# EAGLE design ampi (EAGLE 9.6.2)
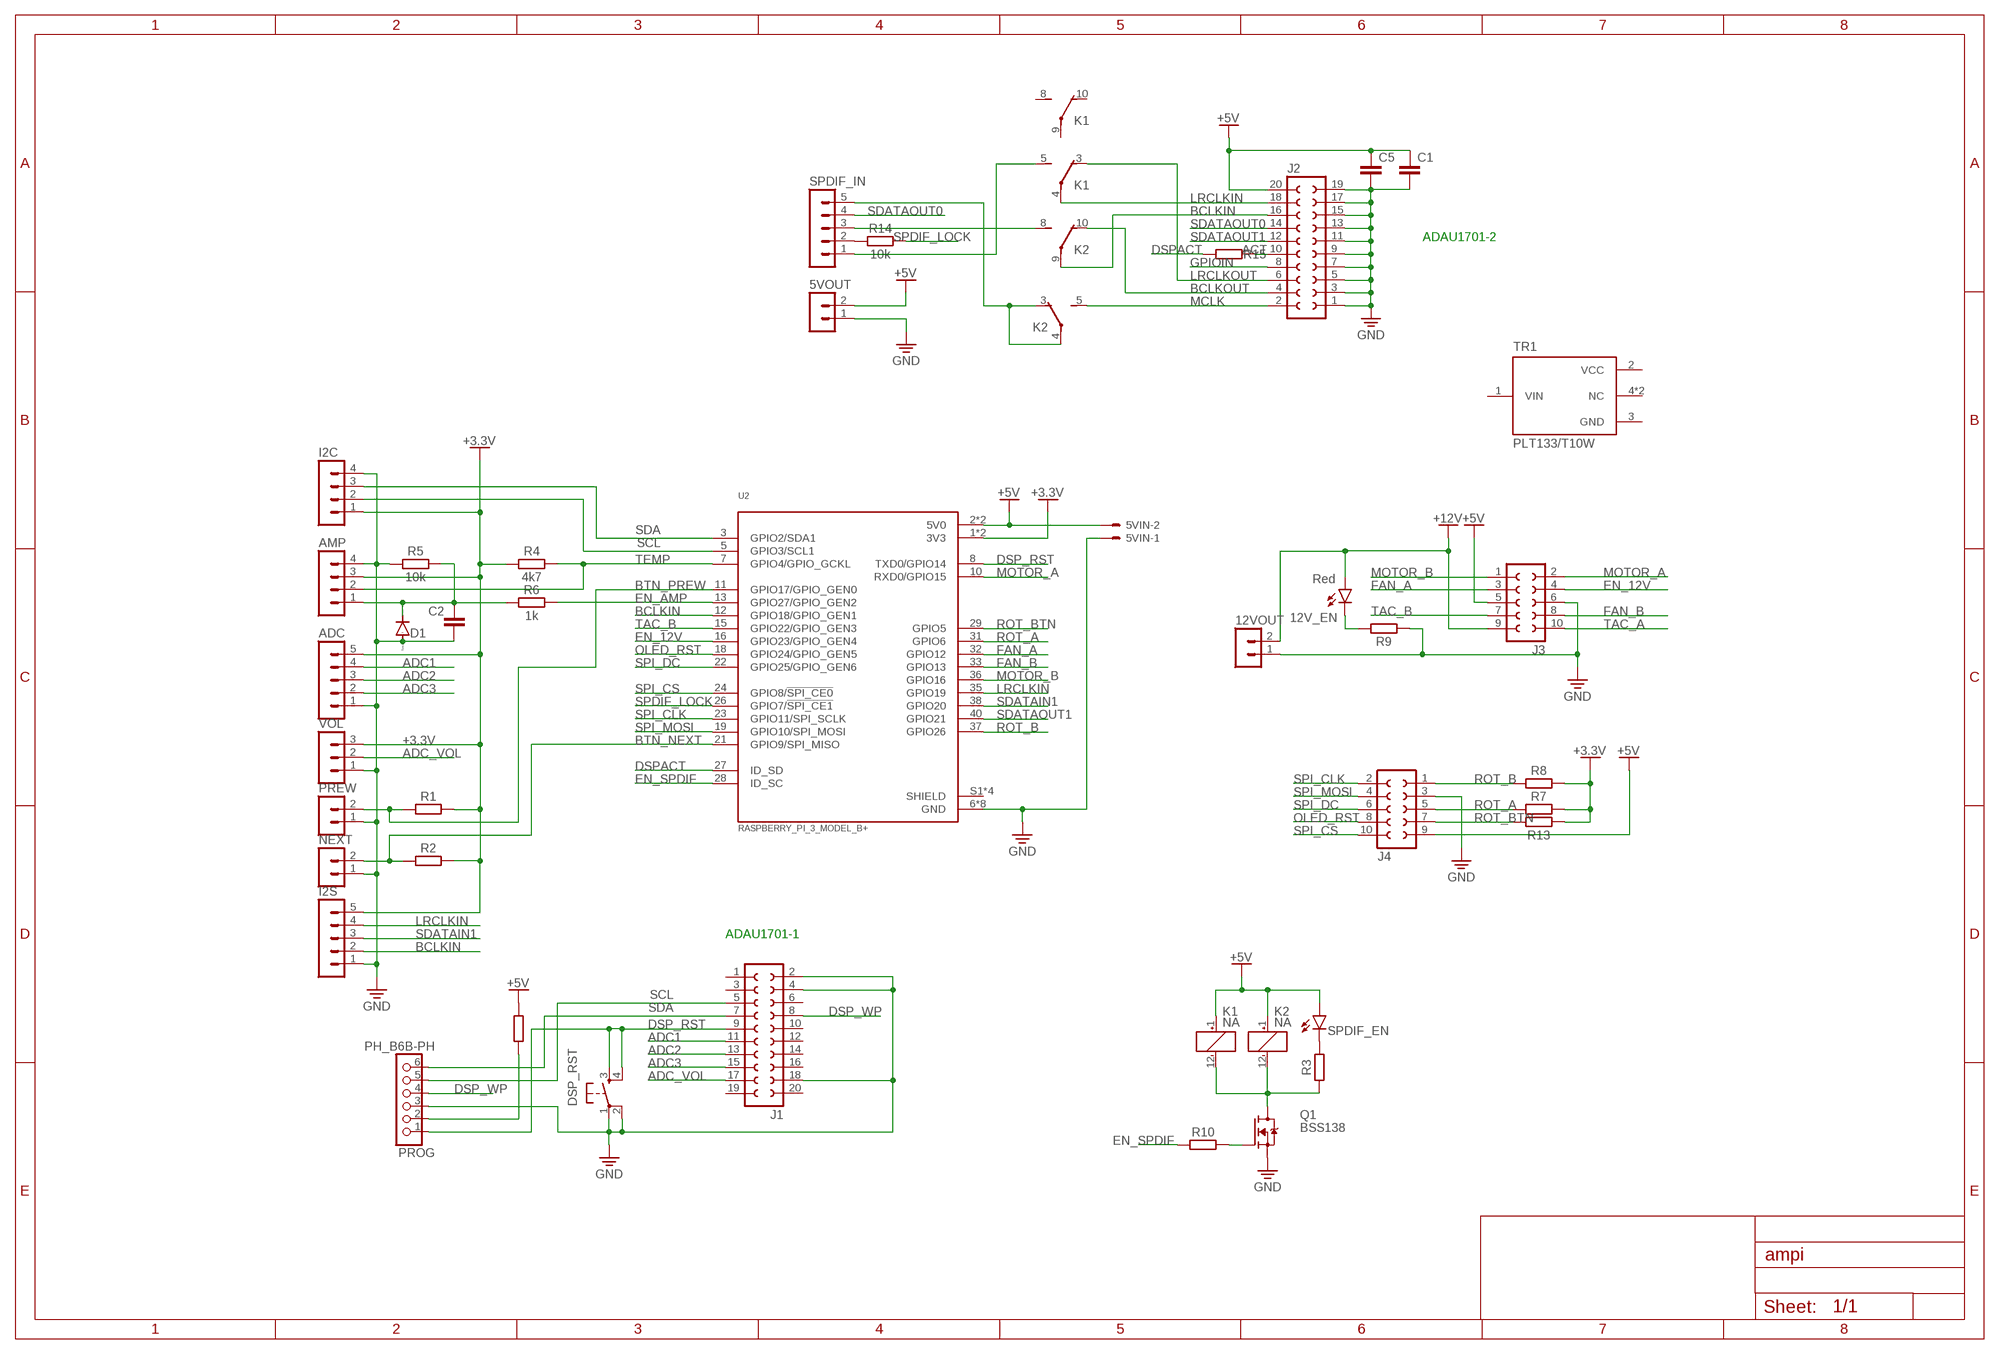
[diagram p0: schematic, sheet 1]

## Parts
5VIN  JST-XH-02-PIN-LONG-PAD  [JST-XH-02-PACKAGE-LONG-PAD]
5VOUT  S2B-EH  [S2B-EH]
12V_EN  Red  LEDCHIP-LED0805  [CHIP-LED0805]
12VOUT  S2B-EH  [S2B-EH]
ADC  S5B-EH  [S5B-EH]
AMP  S4B-EH  [S4B-EH]
C1  C7.5/4  [C7.5B4]
C2  C_CHIP-0603(1608-METRIC)  [CAPC1608X85]
C5  C-EUC0805K  [C0805K]
D1  CGRM4001-G  [SOD-123_MINI-SMA]
DSP_RST  DTS-6  [DTS-6]
I2C  S4B-EH  [S4B-EH]
I2S  S5B-EH  [S5B-EH]
J1  SOCKET-20V  [S20V]
J2  SOCKET-20V  [S20V]
J3  SOCKET-10V  [S10V]
J4  SOCKET-10V  [S10V]
K1  NA  [NA]
K2  NA  [NA]
NEXT  S2B-EH  [S2B-EH]
PREW  S2B-EH  [S2B-EH]
PROG  PH_B6B-PH  [B6B-PH]
Q1  BSS138  [SOT23]
R1  R_CHIP-0603(1608-METRIC)  [RESC1608X60]
R2  R_CHIP-0603(1608-METRIC)  [RESC1608X60]
R3  R_CHIP-0603(1608-METRIC)  [RESC1608X60]
R4  4k7  R_CHIP-0603(1608-METRIC)  [RESC1608X60]
R5  10k  R_CHIP-0603(1608-METRIC)  [RESC1608X60]
R6  1k  R_CHIP-0603(1608-METRIC)  [RESC1608X60]
R7  R_CHIP-0603(1608-METRIC)  [RESC1608X60]
R8  R_CHIP-0603(1608-METRIC)  [RESC1608X60]
R9  R_CHIP-0603(1608-METRIC)  [RESC1608X60]
R10  R_CHIP-0603(1608-METRIC)  [RESC1608X60]
R12  R_CHIP-0402(1005-METRIC)  [RESC1005X40]
R13  R_CHIP-0603(1608-METRIC)  [RESC1608X60]
R14  10k  R_CHIP-0603(1608-METRIC)  [RESC1608X60]
R15  R_CHIP-0603(1608-METRIC)  [RESC1608X60]
SPDIF_EN  LEDCHIP-LED0805  [CHIP-LED0805]
SPDIF_IN  S5B-EH  [S5B-EH]
TR1  PLT133/T10W  [XDCR_PLT133/T10W]
U2  RASPBERRY_PI_3_MODEL_B+  [MODULE_RASPBERRY_PI_3_MODEL_B+]
VOL  S3B-EH  [S3B-EH]

## Nets
+3.3V: ADC.5 AMP.3 I2C.1 I2S.5 R1.2 R2.2 R4.1 R7.2 R8.2 R13.2 U2.1(3V3) U2.17(3V3) VOL.3
+5V: 5VIN.2 5VOUT.2 C1.1 C5.1 J2.20 J3.5 J4.9 K1.1(1:+) K2.1(1:+) R12.2 SPDIF_EN.A U2.2(5V0) U2.4(5V0)
+12V: 12V_EN.A 12VOUT.2 J3.9
ACT: J2.10 R15.2
ADC1: ADC.4 J1.11
ADC2: ADC.3 J1.13
ADC3: ADC.2 J1.15
ADC_VOL: J1.17 VOL.2
BCLKIN: I2S.2 J2.16 K2.9(3:P) U2.12(GPIO18/GPIO_GEN1)
BCLKOUT: J2.4 K2.10(3:O)
BTN_NEXT: NEXT.2 R2.1 U2.21(GPIO9/SPI_MISO)
BTN_PREW: PREW.2 R1.1 U2.11(GPIO17/GPIO_GEN0)
DSP_RST: DSP_RST.3 DSP_RST.4 J1.9 PROG.1 U2.8(TXD0/GPIO14)
DSP_WP: J1.8 PROG.4
DSPACT: R15.1 U2.27(ID_SD)
EN_12V: J3.4 U2.16(GPIO23/GPIO_GEN4)
EN_AMP: R6.2 U2.13(GPIO27/GPIO_GEN2)
EN_SPDIF: R10.1 U2.28(ID_SC)
FAN_A: J3.3 U2.32(GPIO12)
FAN_B: J3.8 U2.33(GPIO13)
GND: 5VIN.1 5VOUT.1 12VOUT.1 ADC.1 AMP.4 C1.2 C2.2 C5.2 D1.A DSP_RST.1 DSP_RST.2 I2C.4 I2S.1 J1.2 J1.4 J1.18 J2.1 J2.3 J2.5 J2.7 J2.9 J2.11 J2.13 J2.15 J2.17 J2.19 J3.6 J4.3 NEXT.1 PREW.1 PROG.3 Q1.2(S) R5.1 R9.2 U2.6(GND) U2.9(GND) U2.14(GND) U2.20(GND) U2.25(GND) U2.30(GND) U2.34(GND) U2.39(GND) VOL.1
GPIOIN: J2.8
LRCLKIN: I2S.4 J2.18 K1.4(2:P) U2.35(GPIO19)
LRCLKOUT: J2.6 K1.3(2:O)
MCLK: J2.2 K2.5(2:S)
MOTOR_A: J3.2 U2.10(RXD0/GPIO15)
MOTOR_B: J3.1 U2.36(GPIO16)
N$1: R3.2 SPDIF_EN.C
N$2: K1.12(1:-) K2.12(1:-) Q1.3(D) R3.1
N$3: R14.1 SPDIF_IN.2
N$6: 12V_EN.C R9.1
N$7: Q1.1(G) R10.2
N$8: K2.8(3:S) SPDIF_IN.3
N$9: K2.3(2:O) K2.4(2:P) SPDIF_IN.5
N$10: PROG.2 R12.1
N$11: K1.5(2:S) SPDIF_IN.1
N$12: AMP.1 C2.1 D1.C R5.2 R6.1
OLED_RST: J4.8 U2.18(GPIO24/GPIO_GEN5)
ROT_A: J4.5 R7.1 U2.31(GPIO6)
ROT_B: J4.1 R8.1 U2.37(GPIO26)
ROT_BTN: J4.7 R13.1 U2.29(GPIO5)
SCL: I2C.2 J1.5 PROG.5 U2.5(GPIO3/SCL1)
SDA: I2C.3 J1.7 PROG.6 U2.3(GPIO2/SDA1)
SDATAIN1: I2S.3 U2.38(GPIO20)
SDATAOUT0: J2.14 SPDIF_IN.4
SDATAOUT1: J2.12 U2.40(GPIO21)
SPDIF_LOCK: R14.2 U2.26(GPIO7/!SPI_CE1!)
SPI_CLK: J4.2 U2.23(GPIO11/SPI_SCLK)
SPI_CS: J4.10 U2.24(GPIO8/!SPI_CE0!)
SPI_DC: J4.6 U2.22(GPIO25/GPIO_GEN6)
SPI_MOSI: J4.4 U2.19(GPIO10/SPI_MOSI)
TAC_A: J3.10
TAC_B: J3.7 U2.15(GPIO22/GPIO_GEN3)
TEMP: AMP.2 R4.2 U2.7(GPIO4/GPIO_GCKL)
Unconnected: J1.1 J1.3 J1.6 J1.10 J1.12 J1.14 J1.16 J1.19 J1.20 K1.8(3:S) K1.9(3:P) K1.10(3:O) TR1.1(VIN) TR1.4(NC) TR1.5(NC)

## Notes on the sheet
- ADAU1701-2
- ADAU1701-1

## Power pins joined to a net without a drawn wire
GND: TR1.3(GND)
SHIELD: U2.S1(SHIELD) U2.S2(SHIELD) U2.S3(SHIELD) U2.S4(SHIELD)
VCC: TR1.2(VCC)

## Library data of the parts
5VIN = Rembrandt Electronics - JST XH Connectors v1-0 (1):JST-XH-02-PIN: JST XH Connector 2 Pin Wire to board connector. Pitch: 2,54 mm, (0.100") Number of pins: 2 Created by Rembrandt Electronics www.rembrandtelectronics.com
5VOUT 12VOUT NEXT PREW = con-JST EH:S2B-EH: JST EH series header 2.50mm pitch disconnectable crimp style connectors, horizontal (side entry type), 2 pins
12V_EN SPDIF_EN = led:LED: LED OSRAM: - CHIPLED LG R971, LG N971, LY N971, LG Q971, LY Q971, LO R971, LY R971 LH N974, LH R974 LS Q976, LO Q976, LY Q976 LO Q996 - Hyper CHIPLED LW Q18S LB Q993, LB Q99A, LB R99A - SideLED LS A670, LO A670, LY A670, LG A670, LP A670 LB A673, LV A673, LT A673, LW A673 LH A674 LY A675 LS A676, LA A676, LO A676, LY A676, LW A676 LS A679, LY A679, LG A679 - Hyper Micro SIDELED® LS Y876, LA Y876, LO Y876, LY Y876 LT Y87S - SmartLED LW L88C, LW L88S LB L89C, LB L89S, LG L890 LS L89K, LO L89K, LY L89K LS L896, LA L896, LO L896, LY L896 - TOPLED LS T670, LO T670, LY T670, LG T670, LP T670 LSG T670, LSP T670, LSY T670, LOP T670, LYG T670 LG T671, LOG T671, LSG T671 LB T673, LV T673, LT T673, LW T673 LH T674 LS T676, LA T676, LO T676, LY T676, LB T676, LH T676, LSB T676, LW T676 LB T67C, LV T67C, LT T67C, LS T67K, LO T67K, LY T67K, LW E67C LS E67B, LA E67B, LO E67B, LY E67B, LB E67C, LV E67C, LT E67C LW T67C LS T679, LY T679, LG T679 LS T770, LO T770, LY T770, LG T770, LP T770 LB T773, LV T773, LT T773, LW T773 LH T774 LS E675, LA E675, LY E675, LS T675 LS T776, LA T776, LO T776, LY T776, LB T776 LHGB T686 LT T68C, LB T68C - Hyper Mini TOPLED® LB M676 - Mini TOPLED Santana® LG M470 LS M47K, LO M47K, LY M47K Source: http://www.osram.convergy.de LUXEON: - LUMILED® LXK2-PW12-R00, LXK2-PW12-S00, LXK2-PW14-U00, LXK2-PW14-V00 LXK2-PM12-R00, LXK2-PM12-S00, LXK2-PM14-U00 LXK2-PE12-Q00, LXK2-PE12-R00, LXK2-PE12-S00, LXK2-PE14-T00, LXK2-PE14-U00 LXK2-PB12-K00, LXK2-PB12-L00, LXK2-PB12-M00, LXK2-PB14-N00, LXK2-PB14-P00, LXK2-PB14-Q00 LXK2-PR12-L00, LXK2-PR12-M00, LXK2-PR14-Q00, LXK2-PR14-R00 LXK2-PD12-Q00, LXK2-PD12-R00, LXK2-PD12-S00 LXK2-PH12-R00, LXK2-PH12-S00 LXK2-PL12-P00, LXK2-PL12-Q00, LXK2-PL12-R00 Source: www.luxeon.com KINGBRIGHT: KA-3528ASYC Source: www.kingbright.com
ADC I2S SPDIF_IN = con-JST EH:S5B-EH: JST EH series header 2.50mm pitch disconnectable crimp style connectors, horizontal (side entry type), 5 pins
AMP I2C = con-JST EH:S4B-EH: JST EH series header 2.50mm pitch disconnectable crimp style connectors, horizontal (side entry type), 4 pins
C1 = capacitor-wima:C: CAPACITOR naming: grid - package width
C2 = Capacitor:C: Capacitor - Generic; CATEGORY: Capacitor
C5 = resistor:C-EU: CAPACITOR, European symbol
D1 = diode:CGRM400*-G: Molded plasitc,JEDEC SOD-123/Mini SMA Source: Comchip CGRM4001-G.pdf
DSP_RST = switch-tact:DTS-6
J1 J2 = con-3m-skt-header:SOCKET-20: 20 pin PCB Socket (3m 85xx/51xx)
J3 J4 = con-3m-skt-header:SOCKET-10: 10 pin PCB Socket (3m 85xx/51xx)
K1 K2 = relay:NA: RELAY; OC_FARNELL: unknown; OC_NEWARK: unknown
PROG = CASE-JST:PH_B6B-PH: JST PH Connector, through hole, 6 pin, top entry Description: JST PH connector with 2.0 mm pitch, through hole version, 6 pin, top entry. Links: Datasheet <http://www.jst-mfg.com/product/pdf/eng/ePH.pdf>
Q1 = bss138_10:BSS138: BSS138 N-Channel Logic Level Enhancement Mode Field Effect Transistor Source: http://www.fairchildsemi.com/datasheets/BS/BSS138.pdf; MF: Fairchild; MPN: BSS138; OC_FARNELL: 9845330; OC_NEWARK: 67R2009
R1-R10 R12-R15 = Resistor:R: Resistor Fixed - Generic; CATEGORY: Resistor; SUB-CATEGORY: Fixed
TR1 = PLT133_T10W:PLT133/T10W: Fiber Optic Transmitter with Driver 660nm 16Mbps 2.7V ~ 5.5V Check prices <https://pricing.snapeda.com/parts/PLT133/T10W/Everlight%20Electronics/view-part?ref=eda>; AVAILABILITY: Warning; DESCRIPTION: Fiber Optic Transmitter with Driver 660nm 16Mbps 2.7V ~ 5.5V; MF: Everlight Electronics; MP: PLT133/T10W; PACKAGE: DIP-5 Everlight; PRICE: None; PURCHASE-URL: https://pricing.snapeda.com/search/part/PLT133/T10W/?ref=eda
U2 = RASPBERRY_PI_3_MODEL_B_:RASPBERRY_PI_3_MODEL_B+: BCM2835 Raspberry Pi Model B+ - ARM11, VideoCore MPU Embedded Evaluation Board; AVAILABILITY: Unavailable; DESCRIPTION: BCM2837B0 Raspberry Pi 3 Model B+ - ARM® Cortex®-A53, VideoCore MPU Embedded Evaluation Board; MF: Raspberry Pi; MP: RASPBERRY PI 3 MODEL B+; PACKAGE: None; PRICE: None
VOL = con-JST EH:S3B-EH: JST EH series header 2.50mm pitch disconnectable crimp style connectors, horizontal (side entry type), 3 pins

## Board
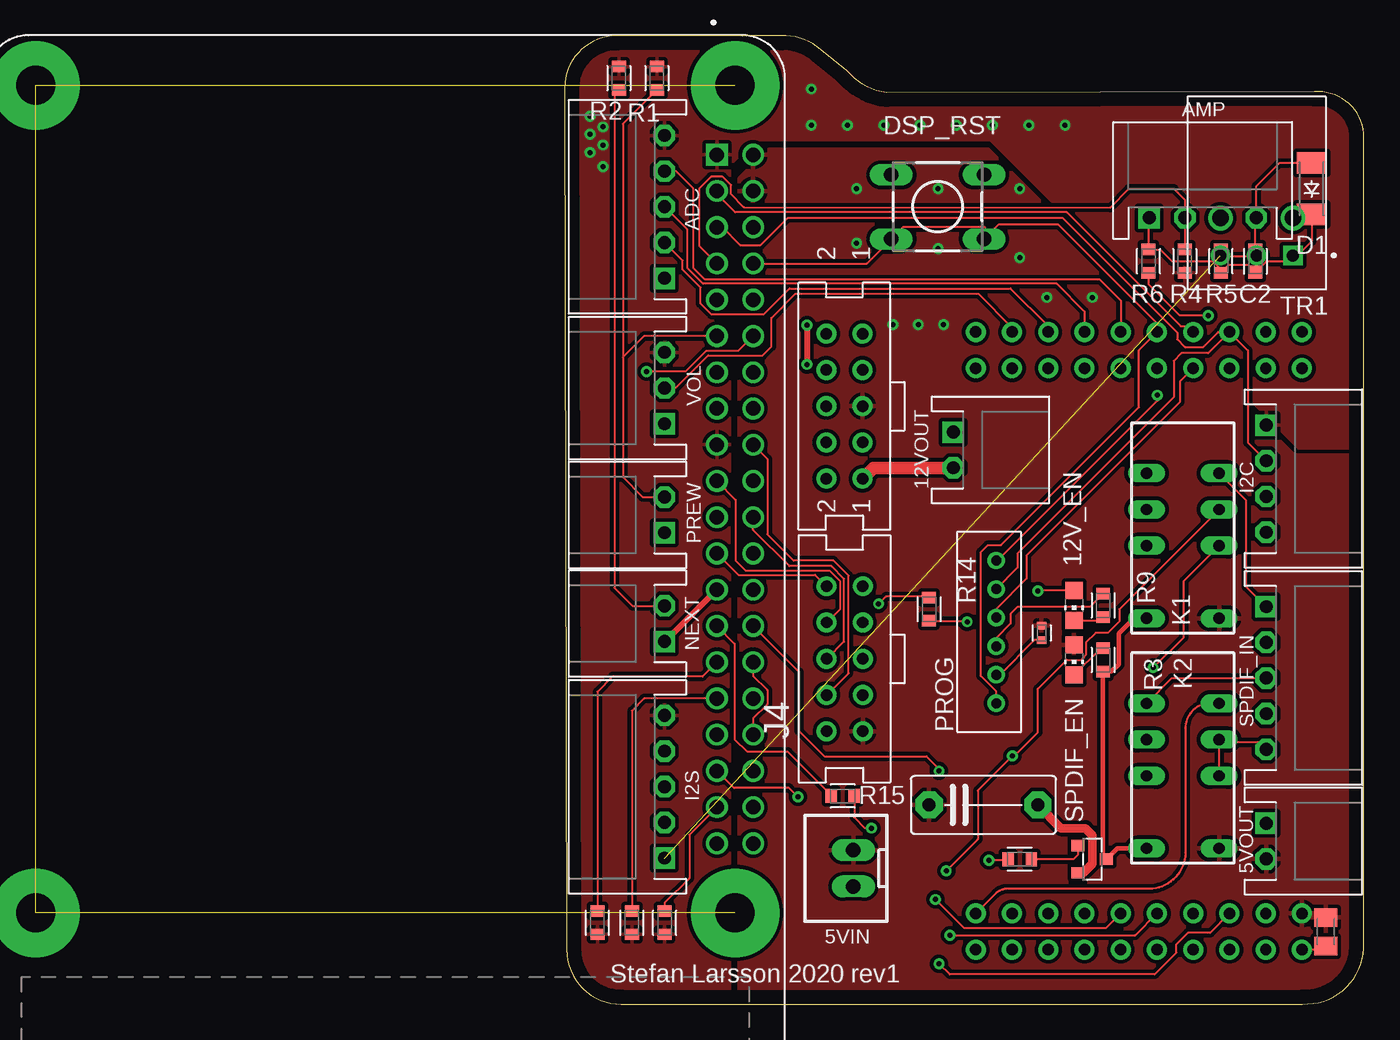
[diagram p1: board, top side]
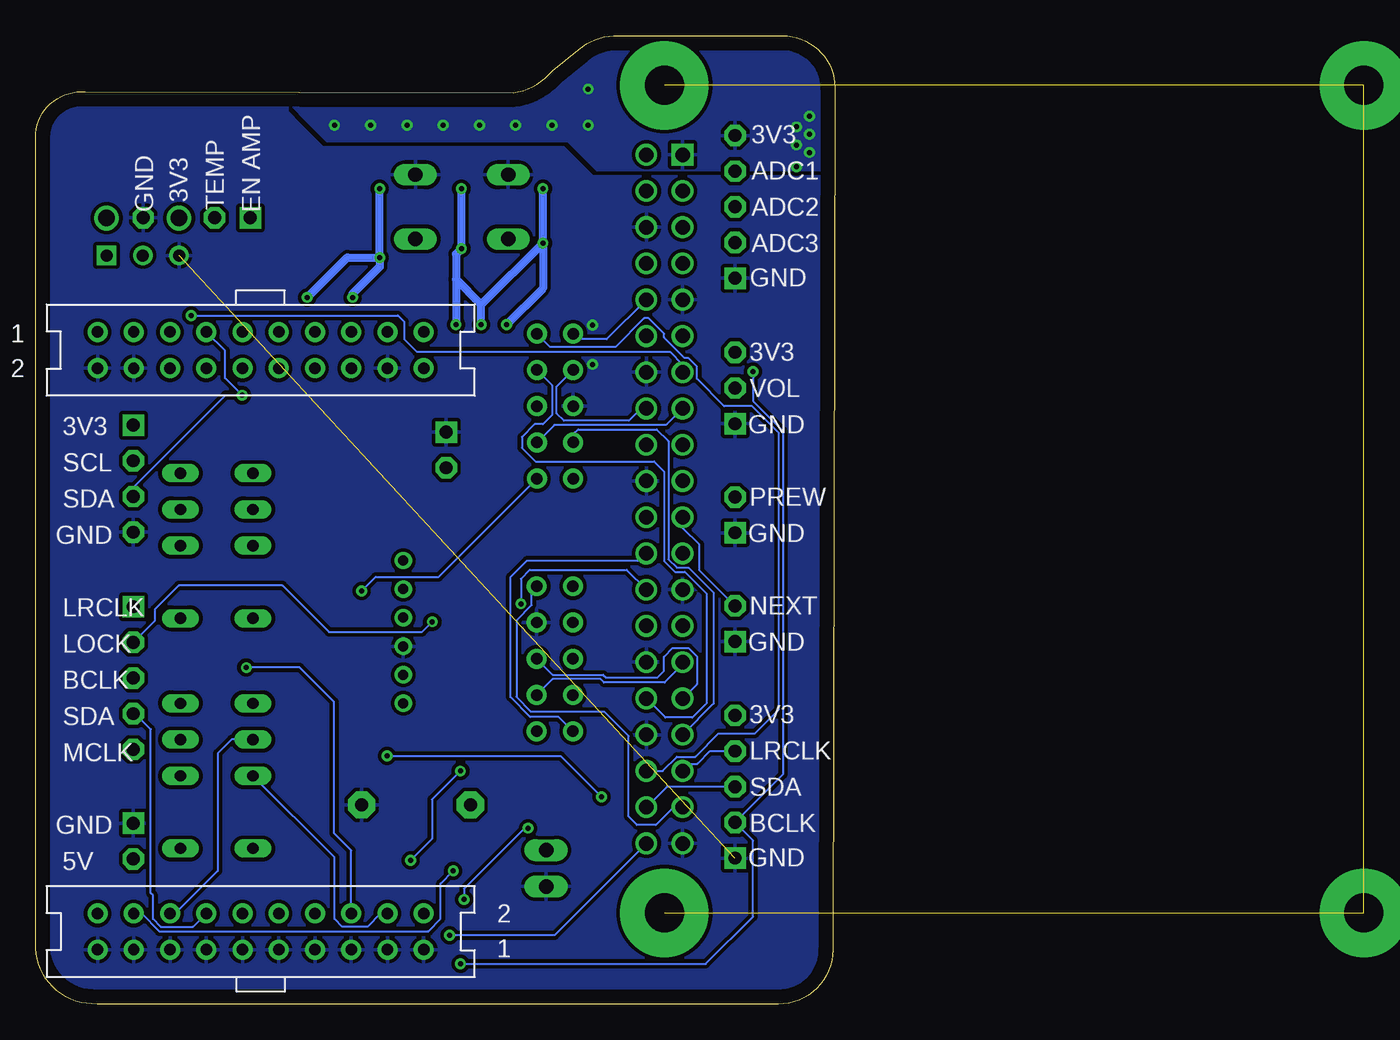
[diagram p2: board, bottom side, seen from below]

Size 55.99 x 67.87 mm. Coordinates in mm from the lower left corner, seen from the top.
Outline: 15.15,67.87 3.63,67.87 arc90 0,64.24 0.13,3.81 arc90 3.96,0 51.69,0 52.06,0.02 arc90 55.99,4.3 55.99,60.72 55.97,61.04 arc90 52.52,63.93 22.55,63.89 arc-45 19.79,65.43 17.94,66.89 arc45 15.15,67.87
Copper layers (1*16): Top 0.035mm / dielectric 1.5mm / Bottom 0.035mm
Design rules "default": minimum track width 6mil, minimum drill 0.35mm, track to track 6mil, track to pad 6mil, pad to pad 6mil, via to via 6mil, smd to smd 6mil, copper to edge 40mil, drill to drill 6mil, minimum pad ring 10mil, minimum via ring 8mil, stop-mask expansion 4mil, vias tented up to drill 0mil, thermal gap 10mil

### Footprints (pad centres in the part's own frame; a part is rotated, then mirrored left to right if it is on the bottom)
JST-XH-02-PACKAGE-LONG-PAD = drill 1.016 long: 1 -1.27,0; 2 1.27,0
S2B-EH = drill 0.9 pad 1.5 square: 1 -1.25,0 | drill 0.9 pad 1.5 octagon: 2 1.25,0
CHIP-LED0805 = smd 1.2 x 1.2: A 0,-1.05; C 0,1.05
S5B-EH = drill 0.9 pad 1.5 square: 1 -5,0 | drill 0.9 pad 1.5 octagon: 2 -2.5,0; 3 0,0; 4 2.5,0; 5 5,0
S4B-EH = drill 0.9 pad 1.5 square: 1 -3.75,0 | drill 0.9 pad 1.5 octagon: 2 -1.25,0; 3 1.25,0; 4 3.75,0
C7.5B4 = drill 0.914 pad 1.905 octagon: 1 -3.81,0; 2 3.81,0
CAPC1608X85 = smd 0.921 x 0.97: 1 -0.775,0; 2 0.775,0
C0805K = smd 1.3 x 1.6: 1 -1,0; 2 1,0
SOD-123_MINI-SMA = smd 1.5 x 2.1: A 1.8,0; C -1.8,0
DTS-6 = drill 1 long: 1 -3.25,2.25; 2 3.25,2.25; 3 -3.25,-2.25; 4 3.25,-2.25
S20V = drill 0.8 pad 1.4: 1 11.43,-1.27; 2 11.43,1.27; 3 8.89,-1.27; 4 8.89,1.27; 5 6.35,-1.27; 6 6.35,1.27; 7 3.81,-1.27; 8 3.81,1.27; 9 1.27,-1.27; 10 1.27,1.27; 11 -1.27,-1.27; 12 -1.27,1.27; 13 -3.81,-1.27; 14 -3.81,1.27; 15 -6.35,-1.27; 16 -6.35,1.27; 17 -8.89,-1.27; 18 -8.89,1.27; 19 -11.43,-1.27; 20 -11.43,1.27
S10V = drill 0.8 pad 1.4: 1 5.08,-1.27; 2 5.08,1.27; 3 2.54,-1.27; 4 2.54,1.27; 5 0,-1.27; 6 0,1.27; 7 -2.54,-1.27; 8 -2.54,1.27; 9 -5.08,-1.27; 10 -5.08,1.27
NA = drill 0.8 long: 1 -6.35,-2.54; 3 -1.27,-2.54; 4 1.27,-2.54; 5 3.81,-2.54; 8 3.81,2.54; 9 1.27,2.54; 10 -1.27,2.54; 12 -6.35,2.54
B6B-PH = drill 0.7: 1 -5,0; 2 -3,0; 3 -1,0; 4 1,0; 5 3,0; 6 5,0
SOT23 = smd 0.8 x 0.9: 1 -0.95,-1; 2 0.95,-1; 3 0,1
RESC1608X60 = smd 0.799 x 0.974: 1 -0.815,0; 2 0.815,0
RESC1005X40 = smd 0.535 x 0.644: 1 -0.507,0; 2 0.507,0
XDCR_PLT133/T10W = drill 0.85 square: 1 -2.54,2.62 | drill 0.85: 2 0,2.62; 3 2.54,2.62 | drill 1.15: 4 -2.54,0; 5 2.54,0
MODULE_RASPBERRY_PI_3_MODEL_B+ = drill 1.016 square: 1 -34.13,23.23 | drill 1.016: 2 -34.13,25.77; 3 -31.59,23.23; 4 -31.59,25.77; 5 -29.05,23.23; 6 -29.05,25.77; 7 -26.51,23.23; 8 -26.51,25.77; 9 -23.97,23.23; 10 -23.97,25.77; 11 -21.43,23.23; 12 -21.43,25.77; 13 -18.89,23.23; 14 -18.89,25.77; 15 -16.35,23.23; 16 -16.35,25.77; 17 -13.81,23.23; 18 -13.81,25.77; 19 -11.27,23.23; 20 -11.27,25.77; 21 -8.73,23.23; 22 -8.73,25.77; 23 -6.19,23.23; 24 -6.19,25.77; 25 -3.65,23.23; 26 -3.65,25.77; 27 -1.11,23.23; 28 -1.11,25.77; 29 1.43,23.23; 30 1.43,25.77; 31 3.97,23.23; 32 3.97,25.77; 33 6.51,23.23; 34 6.51,25.77; 35 9.05,23.23; 36 9.05,25.77; 37 11.59,23.23; 38 11.59,25.77; 39 14.13,23.23; 40 14.13,25.77 | drill 2.75 pad 6.2: S1 -39,24.5; S2 19,24.5; S3 19,-24.5; S4 -39,-24.5
S3B-EH = drill 0.9 pad 1.5 square: 1 -2.5,0 | drill 0.9 pad 1.5 octagon: 2 0,0; 3 2.5,0

### Placement (x,y rotation side)
5VIN  20.23,9.52 90 top
5VOUT  49.15,11.43 270 top
12V_EN  35.69,27.94 180 top
12VOUT  27.23,38.84 270 top
ADC  6.99,55.88 90 top
AMP  44.7,55.12 0 top
C1  29.34,13.97 0 top
C2  48.39,52.07 90 top
C5  53.32,5.08 270 top
D1  52.32,57.15 90 top
DSP_RST  26.13,55.88 0 top
I2C  49.15,36.83 270 top
I2S  6.99,15.24 90 top
J1  40.23,45.84 180 bottom
J2  40.23,5.09 0 bottom
J3  19.59,41.91 90 top
J4  19.61,24.21 90 top
K1  43.31,33.4 90 top
K2  43.31,17.27 90 top
NEXT  6.99,26.67 90 top
PREW  6.99,34.29 90 top
PROG  30.23,26.09 90 top
Q1  36.96,10.16 270 top
R1  6.45,64.9 90 top
R2  3.79,64.9 90 top
R3  37.72,24.13 90 top
R4  43.43,52.07 90 top
R5  45.97,52.07 270 top
R6  40.89,52.07 270 top
R7  4.7,5.71 270 top
R8  6.99,5.71 270 top
R9  37.72,27.94 90 top
R10  31.88,10.16 0 top
R12  33.41,26.02 90 top
R13  2.29,5.71 270 top
R14  25.53,27.69 90 top
R15  19.48,14.59 0 top
SPDIF_EN  35.69,24.13 180 top
SPDIF_IN  49.15,22.86 270 top
TR1  48.48,55.09 180 top
U2  -12.57,25.4 270 top
VOL  6.99,43.18 90 top

### Tracks (layer width: path | path; a pad name or v marks a point on that pad's centre or on a via)
+3.3V  (via drill 0.35)
  other vias: 2.67,60.21 1.78,60.96 1.78,62.23 2.67,61.48 2.67,58.69 1.78,59.69 19.81,61.59 17.27,61.59 17.27,64.14 22.35,61.59 24.89,61.59 35.05,61.59 32.51,61.59 29.97,61.59 27.43,61.59
  pour Top (isolate 0.254): 11.56,58.8 13.33,60.58 29.84,60.58 35.05,55.37 51.44,38.99 62.36,38.99 62.36,70.51 -3.68,70.51 -3.68,-2.67 11.56,-2.67 11.56,56.52 11.51,56.56
  pour Bottom (isolate 0.254, rank 2): -1.14,68.58 -1.14,58.42 16.64,58.42 18.67,60.45 35.56,60.45 39.5,64.39 39.5,68.58
+5V  (via drill 0.35)
  Bottom 0.559: v20.45,53.34 20.45,50.17 v22.99,47.62 | v20.45,53.34 v20.45,57.15 | 26.54,50.8 v26.54,47.62 | 26.54,50.8 26.54,52.58 v26.16,52.96 v26.16,57.15 | v31.88,52.32 v31.88,57.15 | v20.45,53.34 24.77,49.02 | v24.77,47.62 24.77,49.02 | 24.77,49.02 26.54,50.8 | v33.78,49.53 33.78,49.78 31.88,51.69 v31.88,52.32 | v36.96,49.53 34.16,52.32 v31.88,52.32
  pour Top (isolate 0.254, rank 2): 12.25,57.84 14.3,59.89 40.57,59.89 62.36,38.1 62.36,-2.67 12.25,-2.67
+12V  (via drill 0.35)
  Top 0.152: 12V_EN.A 33.18,28.99 v33.15,28.96
  Top 0.889: 12VOUT.2 21.61,37.58 J3.9
  Bottom 0.152: J3.9 27.74,29.95 32.16,29.95 v33.15,28.96
ACT  (via drill 0.35)
  Top 0.152: R15.2 20.29,13.09 21.04,12.34 v21.48,12.34 | J2.10 37.94,5.34 27.98,5.34 v25.98,7.34
  Bottom 0.152: v21.48,12.34 21.73,12.34 25.98,8.09 v25.98,7.34
ADC1
  Top 0.152: ADC.4 7.79,58.38 9.02,57.15 9.02,51.59 9.81,50.79 37.48,50.79 38.96,49.31 J1.11
ADC2
  Top 0.152: ADC.3 8.59,54.28 8.59,51.59 9.69,50.49 34.48,50.49 36.42,48.55 J1.13
ADC3
  Top 0.152: ADC.2 8.26,52.11 8.26,51.49 9.52,50.22 9.52,49.11 10.3,48.33 13.92,48.33 15.76,50.17 31.23,50.17 33.88,47.52 J1.15
ADC_VOL
  Top 0.152: VOL.2 7.75,43.18 10.04,45.47 13.86,45.47 14.48,46.09 14.48,48.09 16.17,49.78 28.98,49.78 31.34,47.42 J1.17
BCLKIN  (via drill 0.35)
  Top 0.152: v26.23,2.84 26.98,2.09 41.33,2.09 42.86,3.62 42.86,4.21 43.65,5 45.22,5 J2.16 | U2.12 12.14,45.78 9.91,45.78 8.48,44.34 v5.73,44.34
  Bottom 0.152: K2.9 42.27,18.54 43.23,17.58 43.23,9.34 46.21,6.36 J2.16 | v26.23,2.84 26.21,2.82 9.05,2.82 5.73,6.14 5.73,11.48 I2S.2 3.61,16.11 3.61,40.16 5.73,42.27 v5.73,44.34
BCLKOUT
  Bottom 0.152: K2.10 35.06,10.29 35.06,5.98 34.51,5.43 32.74,5.43 31.81,6.36 J2.4
BTN_NEXT
  Top 0.152: R2.1 3.48,63.77 3.48,29.18 4.74,27.92 NEXT.2
  Bottom 0.152: NEXT.2 9.48,30.41 9.48,32.2 10.66,33.38 U2.21
BTN_PREW
  Top 0.152: R1.1 4.07,61.7 4.07,45.34 | 4.07,45.34 4.07,36.93 5.46,35.54 PREW.2 | U2.11 5.56,46.83 4.07,45.34
DSP_RST
  Top 0.152: U2.8 21.16,51.91 DSP_RST.3 23.7,54.45 29.45,54.45 29.45,53.7 DSP_RST.4 30.38,54.63 34.6,54.63 41.5,47.73 J1.9 40.23,45.84 40.23,41.84 30.56,32.17 29.63,32.17 29.14,31.68 29.14,23 30.23,21.91 PROG.1
DSP_WP
  Top 0.152: J1.8 43.1,43.63 43.1,42.2 32.36,31.46 32.36,29.82 30.23,27.69 PROG.4
DSPACT
  Top 0.152: U2.27 11.9,25.26 11.9,18.57 12.79,17.69 15.63,17.69 18.66,14.66 R15.1
EN_12V
  Bottom 0.152: U2.16 13.57,41.75 14.42,40.89 18.98,40.89 19.48,41.39 19.48,43.29 J3.4
EN_AMP  (via drill 0.35)
  Top 0.152: v45.08,48.26 43.1,48.26 40.89,50.47 R6.2
  Bottom 0.152: U2.13 10.66,44.82 11.56,45.72 29.28,45.72 30.17,46.61 30.17,47.82 30.61,48.26 v45.08,48.26
EN_SPDIF  (via drill 0.35)
  Top 0.152: U2.28 16.41,23.3 16.41,19.16 18.18,17.38 25.34,17.38 26.23,16.5 v26.23,16.34 | R10.1 30.99,10.09 v29.73,10.09
  Bottom 0.152: v26.23,16.34 28.23,14.34 28.23,11.59 v29.73,10.09
FAN_A
  Bottom 0.152: J3.3 19.81,43.4 19.81,41.28 20.44,40.64 21.02,40.64 21.92,39.75 21.92,38.98 20.96,38.03 12.66,38.03 11.95,37.33 11.95,31.05 11.19,30.29 10.5,30.29 8.98,28.77 8.98,21.09 9.98,20.09 11.86,20.09 U2.32
FAN_B
  Bottom 0.152: U2.33 8.48,21.07 8.48,28.84 10.24,30.6 11.07,30.6 11.65,31.18 11.65,39.46 12.48,40.28 17.98,40.28 18.32,39.94 J3.8
GND  (via drill 0.35)  (1 unrouted)
  Top 0.152: 36.35,9.21 Q1.2 | D1.A 50.07,58.95 48.45,57.33 AMP.4 48.39,55.05 C2.2 47.92,52.38 46.48,52.38 R5.1 | 7.03,25.42 NEXT.1 | U2.30 13.2,23 14.19,22.01 14.19,21.02 13.2,20.03 U2.34 | R9.2 36.8,27.84 31.73,27.84 31.23,27.35 31.23,26.67 30.23,25.66 PROG.3 | C5.2 53.06,3.82 J2.19
  Top 0.406: U2.25 7.03,25.42 | v16.98,47.59 v16.98,44.84
  Top 0.61: C1.2 34.78,12.34 36.48,12.34 36.98,11.84 36.98,9.84 36.35,9.21
  pour Bottom (isolate 0.254, rank 3): -3.68,-2.67 -3.68,70.67 62.36,70.54 62.36,-2.67
LRCLKIN  (via drill 0.35)
  Top 0.152: v16.34,14.53 15.72,15.15 11.86,15.15 U2.35 | K1.4 38.85,27.67 38.85,26.82 38.06,26.04 37.21,26.04 36.52,25.34 36.52,24.49 36.38,24.35 36.38,24.29 36.22,24.13 35.18,24.13 33.15,22.1 33.15,19.05 31.5,17.4 v31.37,17.4 28.94,14.97 28.94,11.56 v26.73,9.34
  Bottom 0.152: v31.37,17.4 19.22,17.4 v16.34,14.53 | U2.35 10.16,16.85 9.62,16.85 8.73,17.74 I2S.4 | v26.73,9.34 27.62,8.45 27.62,5.98 28.47,5.13 47.34,5.13 48.57,6.36 J2.18
LRCLKOUT  (via drill 0.35)
  Top 0.152: v41.23,23.59 v41.24,23.59 43.36,25.72 43.36,29.65 K1.3
  Bottom 0.152: v41.23,23.59 37.48,23.59 35.08,21.19 35.08,11.98 33.88,10.78 J2.6
MCLK
  Top 0.152: K2.5 45.22,21.08 arc90 43.48,19.34 43.48,10.63 arc-90 40.94,8.09 31.02,8.09 arc45 30.18,7.74 J2.2
MOTOR_A
  Bottom 0.152: J3.2 17.93,46.59 15.97,46.59 U2.10
MOTOR_B
  Bottom 0.152: U2.36 12.06,16.35 11.07,17.34 9.77,17.34 8.14,18.97 5.6,18.97 3.92,20.65 3.92,40.03 5.8,41.91 7.75,41.91 9.67,43.83 9.67,44.7 10.25,45.28 10.51,45.28 11.95,46.72 11.95,46.99 13.04,48.08 13.35,48.08 15.37,46.06 19.93,46.06 J3.1
N$1
  Top 0.152: SPDIF_EN.C 37.55,24.94 R3.2
N$2
  Top 0.152: 39.88,27.05 K1.12 | 38.72,10.92 38.73,10.92 | Q1.3 37.81,10.16 37.72,10.25
  Top 0.305: 39.88,27.05 38.82,25.99 38.82,23.83 38.3,23.32 R3.1 37.72,10.25 | Q1.3 38.72,10.92 | 38.73,10.92 K2.12
N$3  (via drill 0.35)
  Top 0.152: R14.1 28.12,26.87 v28.19,26.8
  Bottom 0.152: v28.19,26.8 28.92,26.08 35.43,26.08 38.69,29.34 45.96,29.34 47.63,27.67 47.63,26.87 SPDIF_IN.2
N$6
  Top 0.152: R9.1 37.48,26.89 12V_EN.C
N$7
  Top 0.152: Q1.1 35.96,10.48 35.64,10.16 R10.2
N$8
  Top 0.152: K2.8 42.55,22.86 SPDIF_IN.3
N$9
  Top 0.152: K2.3 K2.4 46.03,18.36 48.65,18.36 SPDIF_IN.5
N$10
  Top 0.152: R12.1 32.91,25.51 30.48,23.09 PROG.2
N$11
  Top 0.152: SPDIF_IN.1 47.75,29.26 47.75,35.31 46.35,36.71 K1.5
N$12
  Top 0.152: AMP.1 40.89,55.06 R6.1 41.72,52.89 42.55,52.06 45.42,52.06 45.97,51.5 R5.2 46.53,51.81 47.87,51.81 C2.1 49.14,52.05 50.9,52.05 52.32,53.47 D1.C
OLED_RST
  Top 0.152: U2.18 14.2,38.21 14.2,32.92 16.03,31.09 18.82,31.09 19.88,30.03 19.88,23.19 18.36,21.67 J4.8
ROT_A
  Top 0.152: U2.31 5.57,21.43 4.7,20.56 R7.1
  Bottom 0.152: U2.31 9.67,22.42 9.67,24.38 10.25,24.96 11.36,24.96 11.98,24.34 11.98,23.34 12.41,22.91 16.04,22.91 16.22,23.09 19.76,23.09 J4.5
ROT_B
  Top 0.152: U2.37 8.73,11.88 8.73,8.84 6.99,7.11 R8.1
  Bottom 0.152: U2.37 11.3,13.81 12.54,12.57 13.86,12.57 14.44,13.15 14.44,18.8 16.14,20.49 21.26,20.49 22.31,21.54 22.31,26.89 21.23,27.97 21.23,28.94 J4.1
ROT_BTN
  Top 0.152: U2.29 9.66,22.97 3.36,22.97 2.29,21.9 R13.1
  Bottom 0.152: U2.29 10.66,23.8 11.91,22.54 16.18,22.54 16.42,22.79 19.77,22.79 J4.7
SCL
  Top 0.152: I2C.2 47.88,39.35 47.88,45.81 J1.5 | U2.5 11.05,54.45 12.29,53.21 13.72,53.21 15.63,55.12 34.87,55.12 42.92,47.07 42.92,46.61 43.46,46.06 44.73,46.06 45.78,47.11 J1.5 | PROG.5 31.73,30.59 31.73,31.59 42.67,42.53 42.67,45.08 43.2,45.62 45.08,45.62 J1.5
SDA  (via drill 0.35)
  Top 0.152: U2.3 10.66,56.78 11.94,55.5 35.17,55.5 43.16,47.52 43.63,47.52 J1.7 | v41.53,42.67 41.53,42.29 30.33,31.09 PROG.6
  Bottom 0.152: I2C.3 49.15,36.22 42.69,42.67 v41.53,42.67 42.73,43.87 42.73,45.8 J1.7
SDATAIN1
  Bottom 0.152: I2S.3 11.77,15.24 U2.38
SDATAOUT0
  Bottom 0.152: SPDIF_IN.4 49.02,20.36 47.92,19.27 47.92,7.78 47.76,7.62 47.76,5.98 47.21,5.43 44.97,5.43 J2.14
SDATAOUT1  (via drill 0.35)
  Top 0.152: v26.98,4.84 39.98,4.84 J2.12
  Bottom 0.152: U2.40 19.63,4.84 v26.98,4.84
SHIELD  (3 unrouted)
SPDIF_LOCK  (via drill 0.35)
  Top 0.152: R14.2 25.45,28.57 22.5,28.57 v21.99,28.06
  Bottom 0.152: U2.26 14.58,30.43 21.37,30.43 21.99,29.81 v21.99,28.06
SPI_CLK
  Top 0.152: U2.23 12.16,30.09 17.54,30.09 J4.2
SPI_CS
  Bottom 0.152: U2.24 13.69,31.1 21.57,31.1 22.73,29.93 22.73,21.53 21.33,20.14 19.34,20.14 J4.10
SPI_DC
  Top 0.152: J4.6 18.36,24.21 19.57,25.42 19.57,29.8 18.68,30.7 15.74,30.7 13.2,33.24 U2.22
SPI_MOSI
  Top 0.152: U2.19 11.98,35.35 11.98,31.09 12.67,30.39 18.55,30.39 19.27,29.68 19.27,27.66 18.36,26.75 J4.4
TAC_B
  Bottom 0.152: U2.15 11.82,40.59 19.64,40.59 J3.7
TEMP
  Top 0.152: U2.7 9.41,53.16 9.41,57.15 10.25,57.98 11.07,57.98 11.65,57.4 11.65,56.76 12.53,55.87 38.21,55.83 39.53,57.14 42.68,57.14 43.45,56.37 AMP.2 43.43,55.1 R4.2

### Text on the board
tPlace: Stefan Larsson 2020 rev1
bNames: EN AMP | TEMP | 3V3 | 3V3 | GND | ADC1 | ADC2 | ADC3 | GND | 3V3 | VOL | GND | 3V3 | SCL | PREW | SDA | GND | GND | NEXT | LRCLK | GND | LOCK | BCLK | 3V3 | SDA | LRCLK | MCLK | SDA | BCLK | GND | GND | 5V